# EasyEDA schematic UV_LED_SH01.json
TITLE: UV_LED_SH01; REV: 1.0; Date: 2023-11-21; Sheet: 1/1; Drawn By: AmirB; Company: Your Company
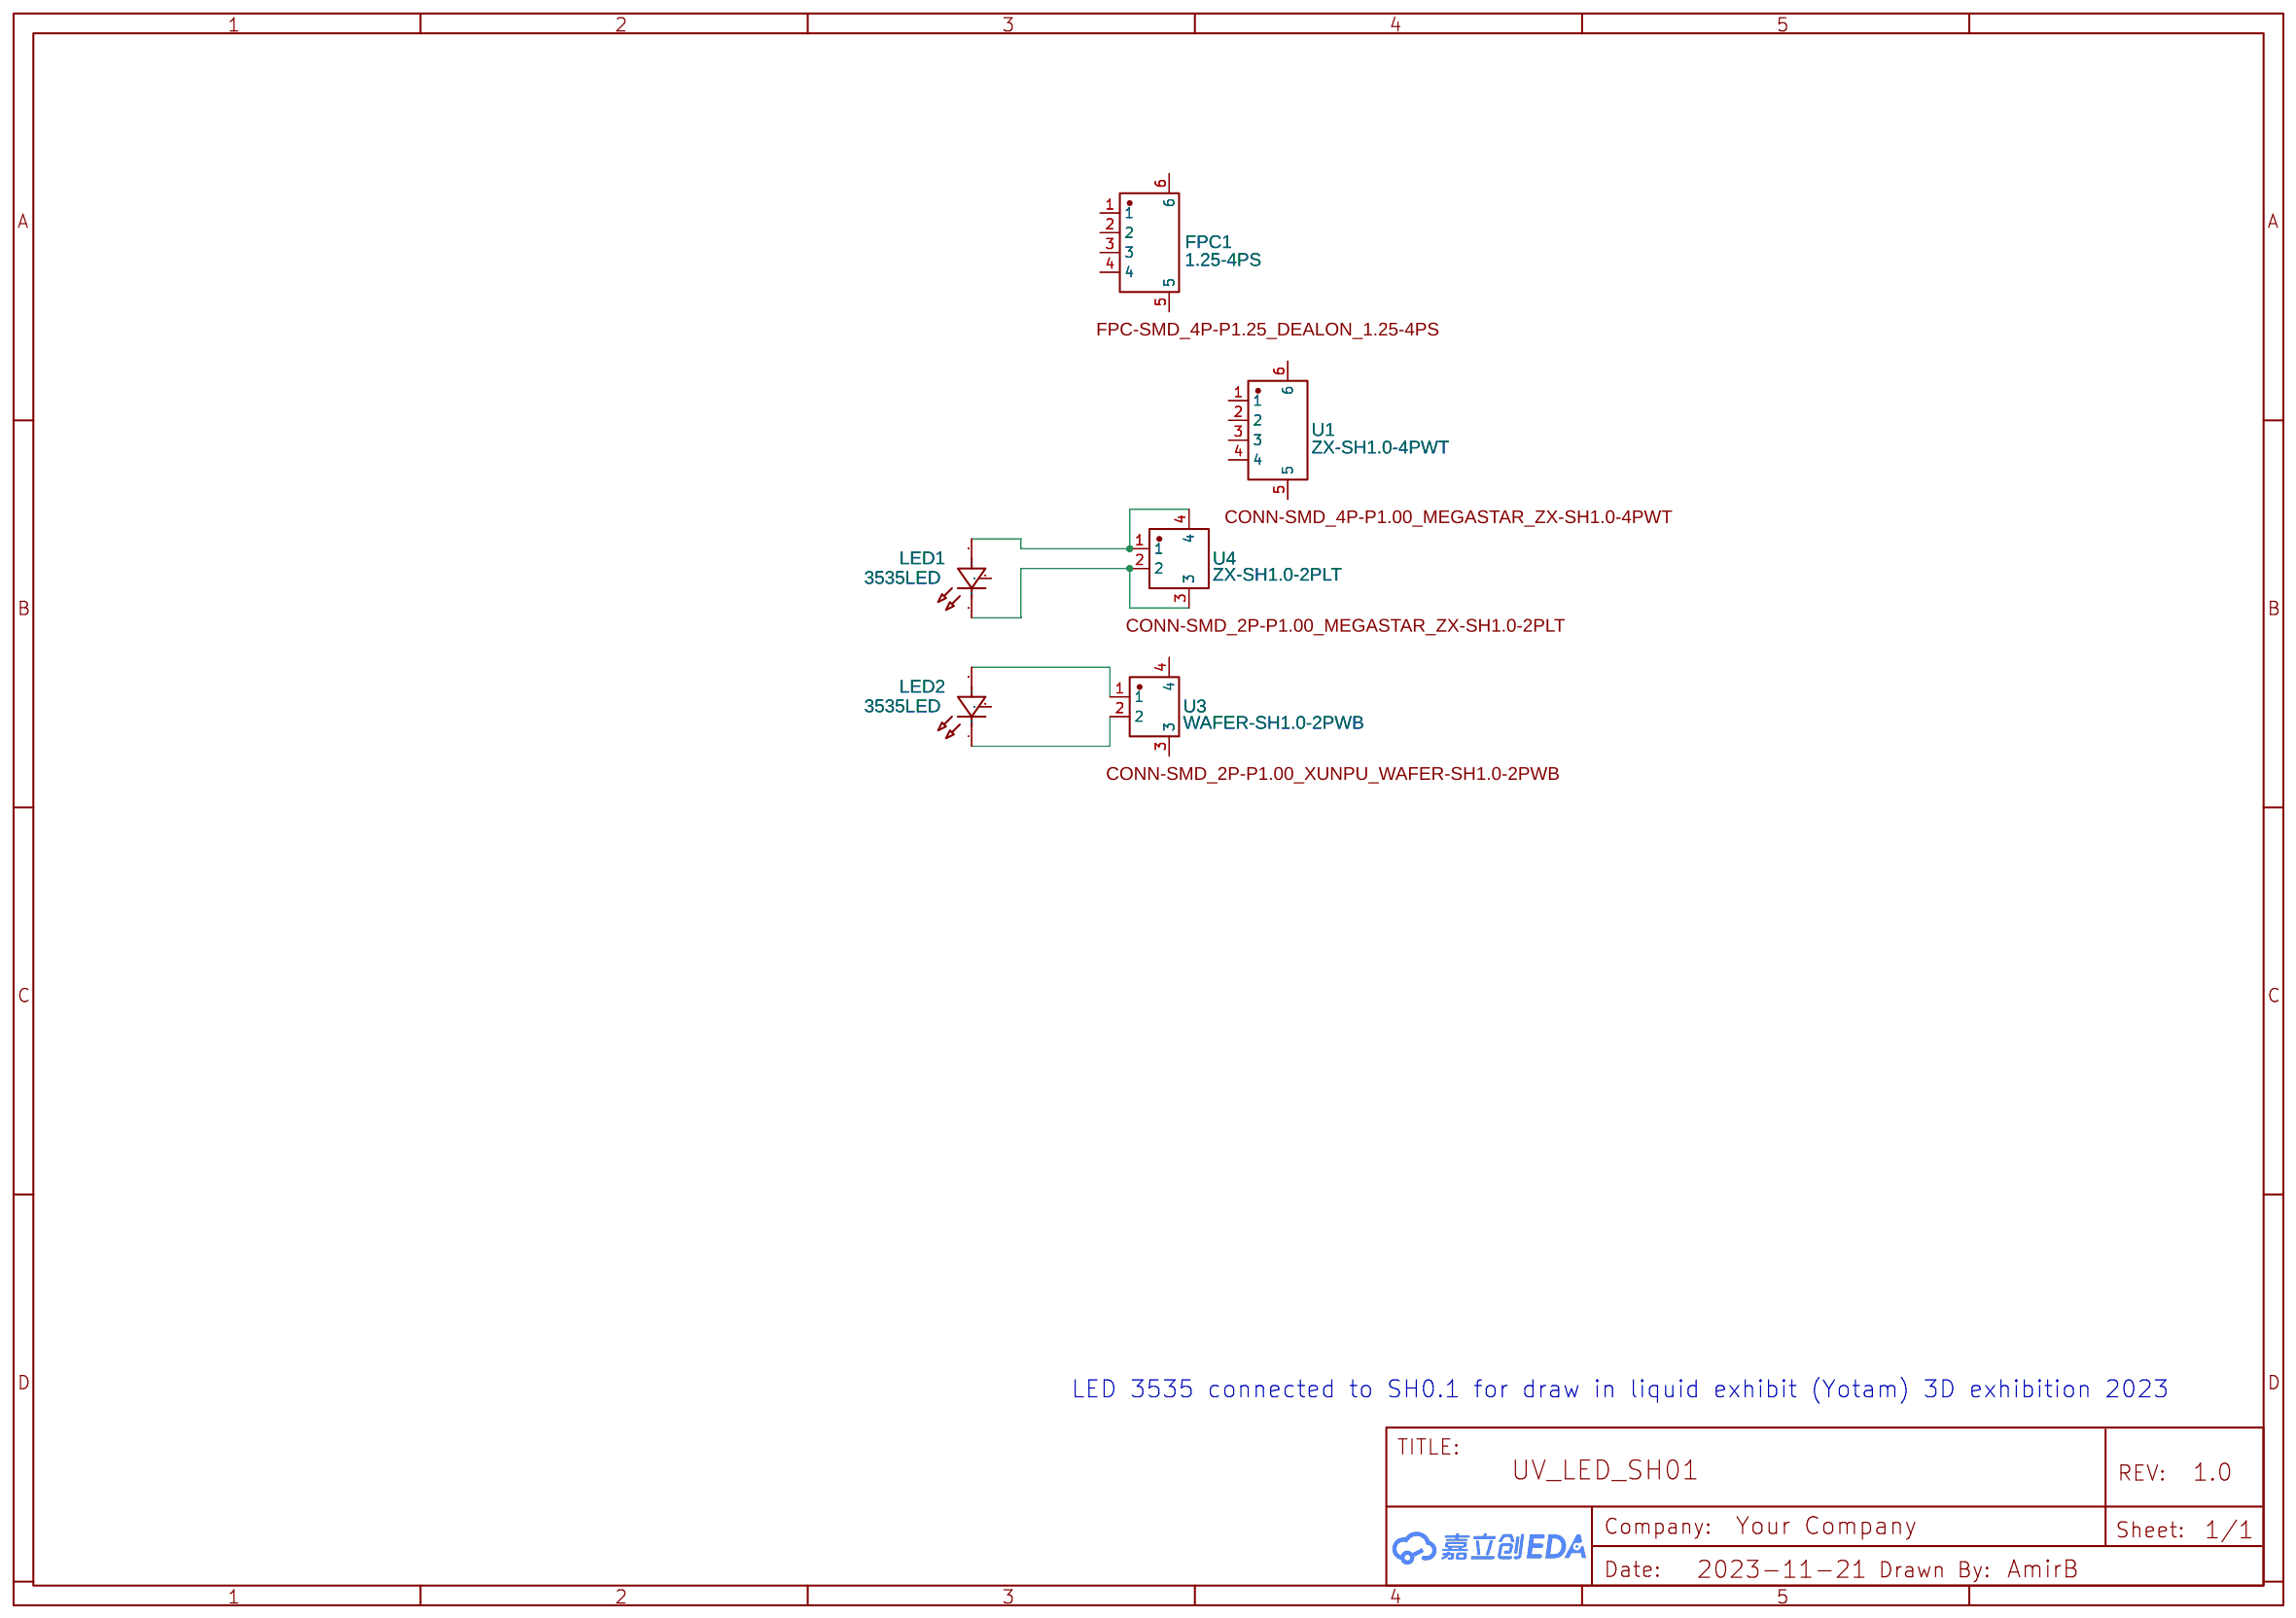
[diagram p0: schematic sheet]

## Parts
FPC1  1.25-4PS  [FPC-SMD_4P-P1.25_DEALON_1.25-4PS]
LED1  3535LED  [LED-SMD_3P-L3.5-W3.5_M3535O1IRS13G06]
LED2  3535LED  [LED-SMD_3P-L3.5-W3.5_M3535O1IRS13G06]
U1  ZX-SH1.0-4PWT  [CONN-SMD_4P-P1.00_MEGASTAR_ZX-SH1.0-4PWT]
U3  WAFER-SH1.0-2PWB  [CONN-SMD_2P-P1.00_XUNPU_WAFER-SH1.0-2PWB]
U4  ZX-SH1.0-2PLT  [CONN-SMD_2P-P1.00_MEGASTAR_ZX-SH1.0-2PLT]

## Library data of the parts
FPC1 = 1.25-4PS: Contributor: LCSC; Supplier: LCSC; Supplier Part: C2904991; Manufacturer: DEALON(德艺隆); JLCPCB Part Class: Extended Part; Package Display: Yes
LED1 LED2 = M3535N1UVS8U06-365NM: Supplier: LCSC; Supplier Part: C2833503; Manufacturer: Silverlight(银月光); Manufacturer Part: M3535N1UVS8U06-365nm; JLCPCB Part Class: Extended Part; Contributor: LCSC
U1 = ZX-SH1.0-4PWT: Contributor: lcsc; Supplier: LCSC; Supplier Part: C7430446; Manufacturer: Megastar(兆星); JLCPCB Part Class: Extended Part; Package Display: Yes
U3 = WAFER-SH1.0-2PWB: Contributor: lcsc; Supplier: LCSC; Supplier Part: C3029341; Manufacturer: XUNPU(讯普); JLCPCB Part Class: Extended Part; Package Display: Yes
U4 = ZX-SH1.0-2PLT: Contributor: lcsc; Supplier: LCSC; Supplier Part: C7430451; Manufacturer: Megastar(兆星); JLCPCB Part Class: Extended Part; Package Display: Yes

## Nets
Net-(LED1-1): LED1.1(K) U4.2 U4.3
Net-(LED1-2): LED1.2(A) U4.1 U4.4
Net-(LED2-1): LED2.1(K) U3.2
Net-(LED2-2): LED2.2(A) U3.1

Not connected (* = marked no-connect by the designer): FPC1 1 2 3 4 5 6; LED1 3; LED2 3; U1 1 2 3 4 5 6; U3 3 4

## Notes on the sheet
- LED 3535 connected to SH0.1 for draw in liquid exhibit (Yotam) 3D exhibition 2023
